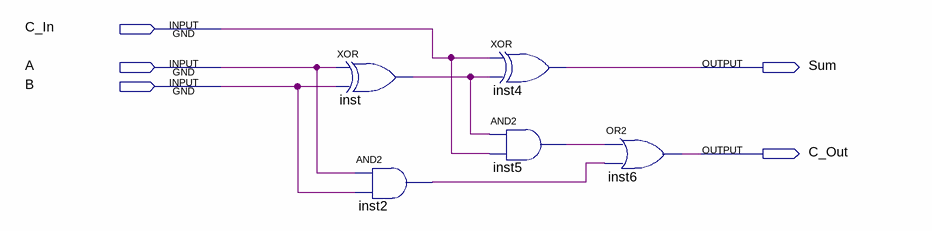
[diagram p0: schematic sheet]
// Quartus schematic Adder.bdf as structural Verilog: 5 symbols, 5 pins
module Adder (
  input  C_In,
  input  A,
  input  B,
  output Sum,
  output C_Out
);

  wire inst2_out, inst5_out, inst_out;

  xor inst (inst_out, A, B);
  and inst2 (inst2_out, A, B);
  xor inst4 (Sum, C_In, inst_out);
  and inst5 (inst5_out, inst_out, C_In);
  or inst6 (C_Out, inst5_out, inst2_out);
endmodule
